# EAGLE design 2732Adapter (EAGLE 7.7.0)
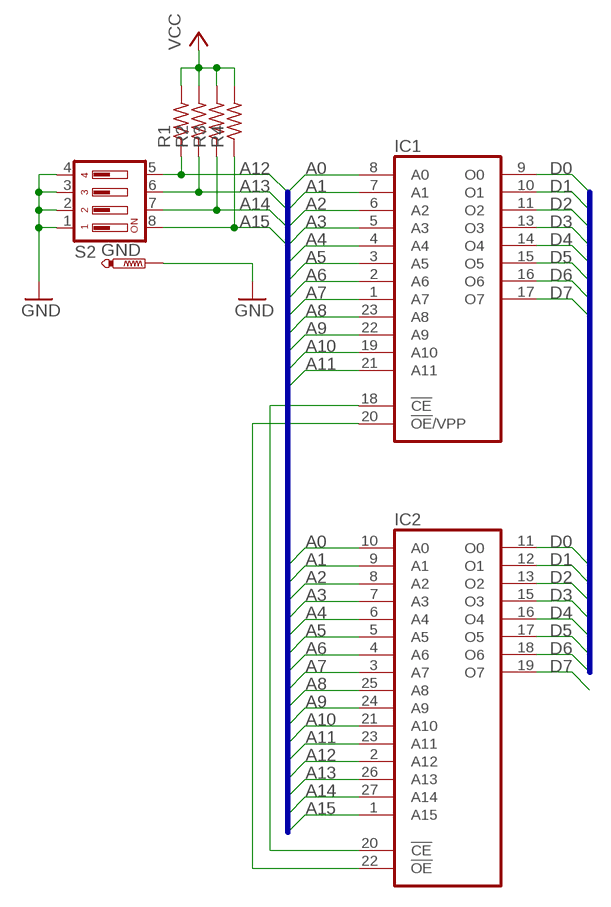
[diagram p0: schematic, sheet 1]

## Parts
GND  PTR1B1,27  [B1,27]
IC1  2732  [DIL24]
IC2  27512  [DIL28]
R1  R-US_0204/5  [0204/5]
R2  R-US_0204/5  [0204/5]
R3  R-US_0204/5  [0204/5]
R4  R-US_0204/5  [0204/5]
S2  DP04  [DP-04]

## Nets
A0: IC1.8(A0) IC2.10(A0)
A1: IC1.7(A1) IC2.9(A1)
A2: IC1.6(A2) IC2.8(A2)
A3: IC1.5(A3) IC2.7(A3)
A4: IC1.4(A4) IC2.6(A4)
A5: IC1.3(A5) IC2.5(A5)
A6: IC1.2(A6) IC2.4(A6)
A7: IC1.1(A7) IC2.3(A7)
A8: IC1.23(A8) IC2.25(A8)
A9: IC1.22(A9) IC2.24(A9)
A10: IC1.19(A10) IC2.21(A10)
A11: IC1.21(A11) IC2.23(A11)
A12: IC2.2(A12) R1.1 S2.5
A13: IC2.26(A13) R2.1 S2.6
A14: IC2.27(A14) R3.1 S2.7
A15: IC2.1(A15) R4.1 S2.8
D0: IC1.9(O0) IC2.11(O0)
D1: IC1.10(O1) IC2.12(O1)
D2: IC1.11(O2) IC2.13(O2)
D3: IC1.13(O3) IC2.15(O3)
D4: IC1.14(O4) IC2.16(O4)
D5: IC1.15(O5) IC2.17(O5)
D6: IC1.16(O6) IC2.18(O6)
D7: IC1.17(O7) IC2.19(O7)
GND: GND.TP S2.1 S2.2 S2.3 S2.4
N$1: IC1.18(!CE) IC2.20(!CE)
N$2: IC1.20(!OE!/VPP) IC2.22(!OE)
VCC: R1.2 R2.2 R3.2 R4.2

## Buses
A[0..15]
D[0..7]

## Power pins joined to a net without a drawn wire
GND: IC1.12(GND) IC2.14(GND)
VCC: IC1.24(VCC) IC2.28(VCC)

## Library data of the parts
GND = testpad:PTR1: TEST PIN
IC1 = memory:2732: MEMORY
IC2 = memory:27512: MEMORY
R1-R4 = resistor:R-US_: RESISTOR, American symbol
S2 = switch-dil:DP04: DIL/CODE SWITCH; MPN: DP04; OC_FARNELL: 9471600; OC_NEWARK: 73J0027

## Board
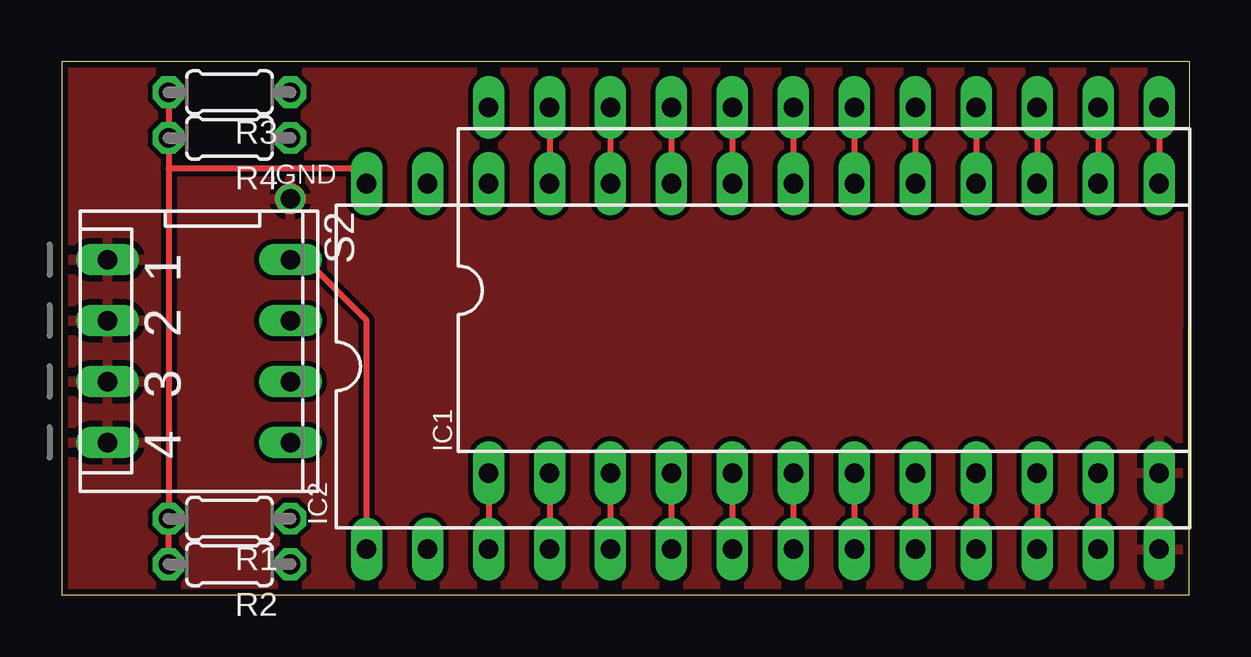
[diagram p1: board, top side]
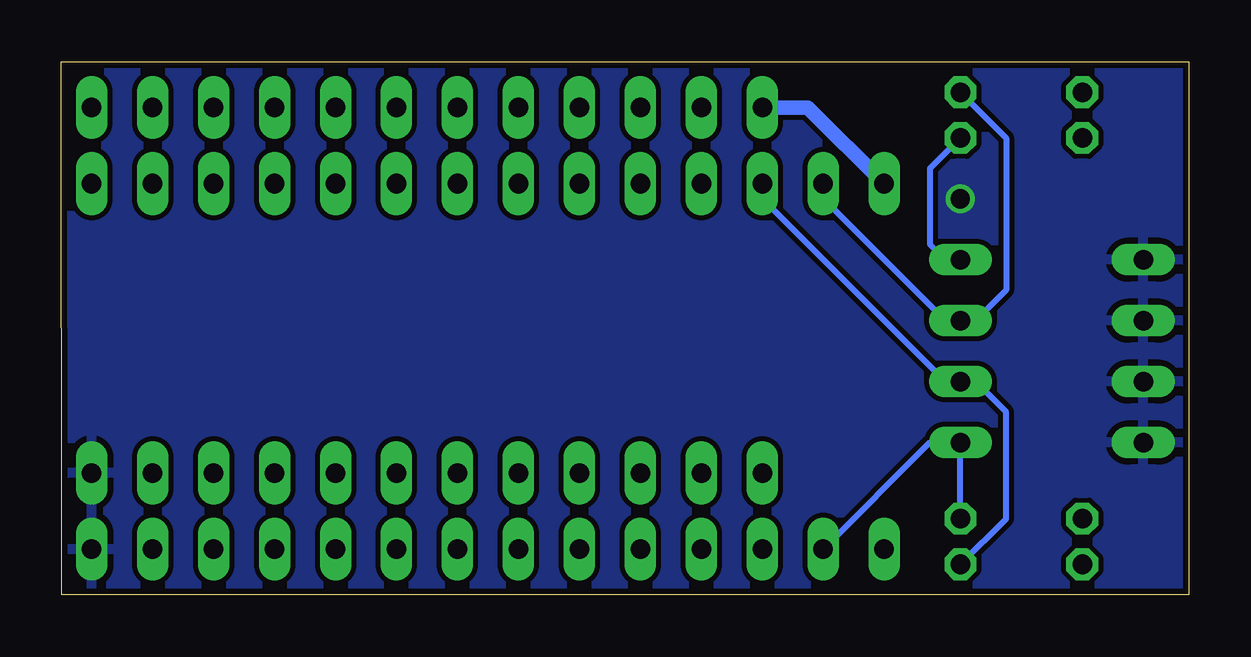
[diagram p2: board, bottom side, seen from below]

Size 46.99 x 22.23 mm. Coordinates in mm from the lower left corner, seen from the top.
Outline: 0,0 46.97,0 46.99,22.23 0,22.23 0,0
Copper layers (1*16): Top 0.035mm / dielectric 1.5mm / Bottom 0.035mm
Design rules "default *": minimum track width 10mil, minimum drill 24mil, track to track 8mil, track to pad 8mil, pad to pad 8mil, via to via 8mil, smd to smd 8mil, copper to edge 10mil, drill to drill 8mil, minimum pad ring 10mil, minimum via ring 8mil, stop-mask expansion 4mil, vias tented up to drill 0mil, thermal gap 10mil

### Footprints (pad centres in the part's own frame; a part is rotated, then mirrored left to right if it is on the bottom)
B1,27 = smd 1.27 x 1.27: TP 0,0
DIL24 = drill 0.813 long: 1 -13.97,-7.62; 2 -11.43,-7.62; 3 -8.89,-7.62; 4 -6.35,-7.62; 5 -3.81,-7.62; 6 -1.27,-7.62; 7 1.27,-7.62; 8 3.81,-7.62; 9 6.35,-7.62; 10 8.89,-7.62; 11 11.43,-7.62; 12 13.97,-7.62; 13 13.97,7.62; 14 11.43,7.62; 15 8.89,7.62; 16 6.35,7.62; 17 3.81,7.62; 18 1.27,7.62; 19 -1.27,7.62; 20 -3.81,7.62; 21 -6.35,7.62; 22 -8.89,7.62; 23 -11.43,7.62; 24 -13.97,7.62
DIL28 = drill 0.813 long: 1 -16.51,-7.62; 2 -13.97,-7.62; 3 -11.43,-7.62; 4 -8.89,-7.62; 5 -6.35,-7.62; 6 -3.81,-7.62; 7 -1.27,-7.62; 8 1.27,-7.62; 9 3.81,-7.62; 10 6.35,-7.62; 11 8.89,-7.62; 12 11.43,-7.62; 13 13.97,-7.62; 14 16.51,-7.62; 15 16.51,7.62; 16 13.97,7.62; 17 11.43,7.62; 18 8.89,7.62; 19 6.35,7.62; 20 3.81,7.62; 21 1.27,7.62; 22 -1.27,7.62; 23 -3.81,7.62; 24 -6.35,7.62; 25 -8.89,7.62; 26 -11.43,7.62; 27 -13.97,7.62; 28 -16.51,7.62
0204/5 = drill 0.813 octagon: 1 -2.54,0; 2 2.54,0
DP-04 = drill 0.813 long: 1 -3.81,-3.81; 2 -1.27,-3.81; 3 1.27,-3.81; 4 3.81,-3.81; 5 3.81,3.81; 6 1.27,3.81; 7 -1.27,3.81; 8 -3.81,3.81

### Placement (x,y rotation side)
GND  9.53,16.51 0 top
IC1  31.75,12.7 0 top
IC2  29.21,9.53 0 top
R1  6.99,3.17 180 top
R2  6.99,1.27 180 top
R3  6.99,20.95 180 top
R4  6.99,19.05 180 top
S2  5.71,10.16 270 top

### Tracks (layer width: path | path; a pad name or v marks a point on that pad's centre or on a via)
A0
  Top 0.254: IC1.8 IC2.10
A1
  Top 0.254: IC1.7 IC2.9
A2
  Top 0.254: IC1.6 IC2.8
A3
  Top 0.254: IC1.5 IC2.7
A4
  Top 0.254: IC1.4 IC2.6
A5
  Top 0.254: IC1.3 IC2.5
A6
  Top 0.254: IC1.2 IC2.4
A7
  Top 0.254: IC1.1 IC2.3
A8
  Top 0.254: IC1.23 IC2.25
A9
  Top 0.254: IC1.22 IC2.24
A10
  Top 0.254: IC1.19 IC2.21
A11
  Top 0.254: IC1.21 IC2.23
A12
  Bottom 0.254: IC2.2 10.79,6.35 S2.5 R1.1
A13
  Bottom 0.254: IC2.26 17.78,16.51 10.16,8.89 S2.6 8.89,8.89 7.62,7.62 7.62,3.17 R2.1
A14
  Bottom 0.254: IC2.27 15.24,16.51 10.16,11.43 S2.7 8.89,11.43 7.62,12.7 7.62,19.05 R3.1
A15
  Top 0.254: IC2.1 12.7,11.43 10.16,13.97 S2.8
  Bottom 0.254: R4.1 10.79,17.78 10.79,14.61 10.16,13.97 S2.8
D0
  Top 0.254: IC1.9 IC2.11
D1
  Top 0.254: IC1.10 IC2.12
D2
  Top 0.254: IC1.11 IC2.13
D3
  Top 0.254: IC1.13 IC2.15
D4
  Top 0.254: IC1.14 IC2.16
D5
  Top 0.254: IC1.15 IC2.17
D6
  Top 0.254: IC1.16 IC2.18
D7
  Top 0.254: IC1.17 IC2.19
GND  (via drill 0.8)
  Top 0.254: IC1.12 IC2.14
  other vias: 9.53,16.51
  pour Top: 0,22.23 46.99,22.23 46.99,0 0,0
  pour Bottom: 0,22.23 46.99,22.23 46.99,0 0,0
N$1
  Top 0.254: IC1.18 IC2.20
N$2
  Top 0.254: IC1.20 IC2.22
VCC
  Top 0.254: R2.2 R1.2 4.45,17.78 | R3.2 R4.2 4.45,17.78 | IC2.28 12.06,17.78 4.45,17.78
  Bottom 0.61: IC2.28 15.88,20.32 IC1.24